# Altium schematic sheet camera_interface.SchDoc
size A3
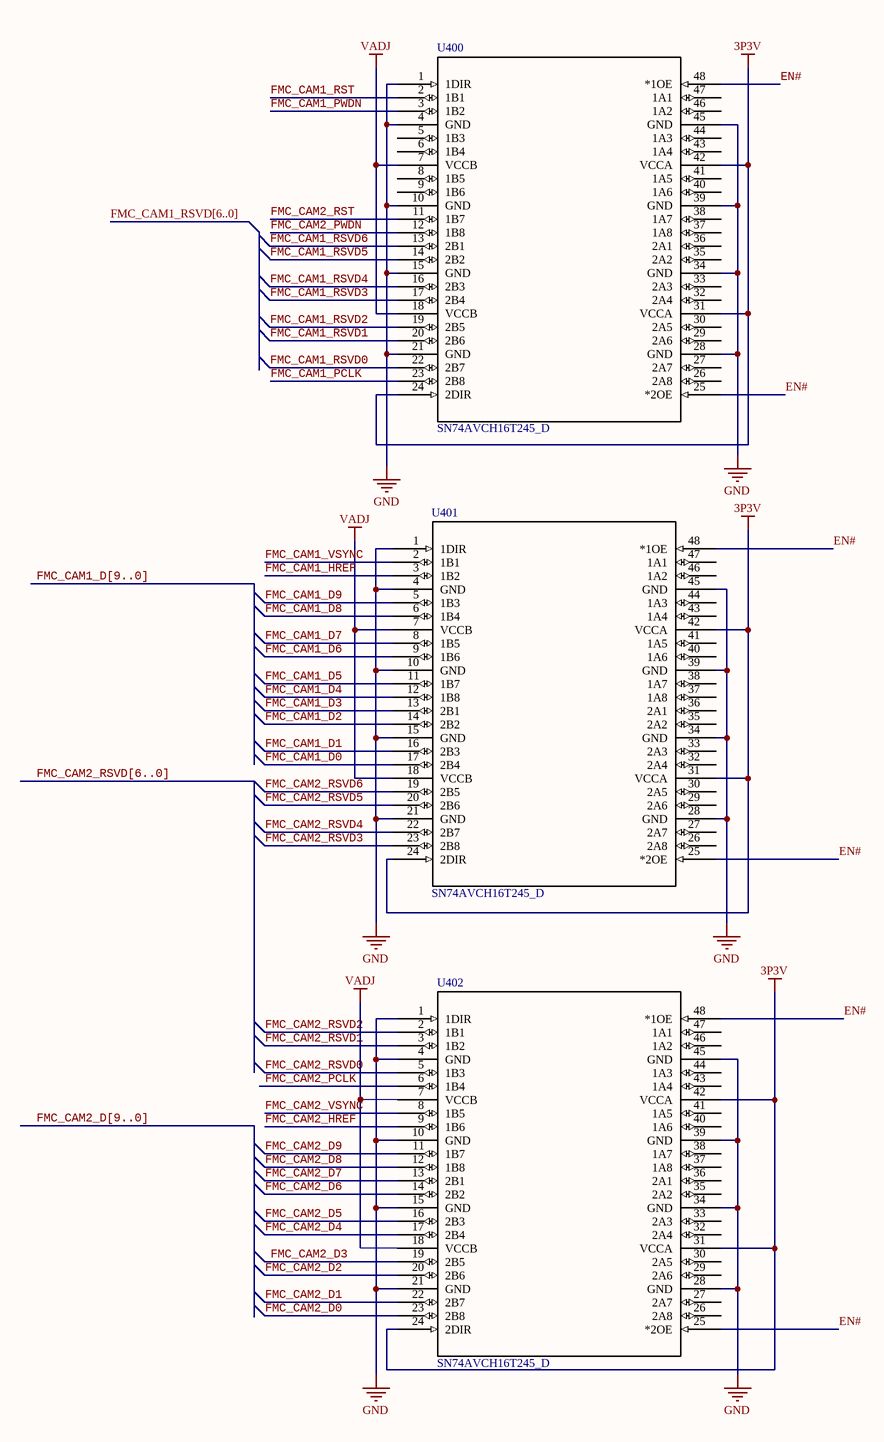
[diagram p0: camera_interface.SchDoc]

## Parts
U400  SN74AVCH16T245_D  [DGV48]
U401  SN74AVCH16T245_D  [DGV48]
U402  SN74AVCH16T245_D  [DGV48]

## Nets
3P3V: U400.24(2DIR) U400.31(VCCA) U400.42(VCCA) U401.24(2DIR) U401.31(VCCA) U401.42(VCCA) U402.24(2DIR) U402.31(VCCA) U402.42(VCCA)
GND: U400.1(1DIR) U400.4(GND) U400.10(GND) U400.15(GND) U400.21(GND) U400.28(GND) U400.34(GND) U400.39(GND) U400.45(GND) U401.1(1DIR) U401.4(GND) U401.10(GND) U401.15(GND) U401.21(GND) U401.28(GND) U401.34(GND) U401.39(GND) U401.45(GND) U402.1(1DIR) U402.4(GND) U402.10(GND) U402.15(GND) U402.21(GND) U402.28(GND) U402.34(GND) U402.39(GND) U402.45(GND)
VADJ: U400.7(VCCB) U400.18(VCCB) U401.7(VCCB) U401.18(VCCB) U402.7(VCCB) U402.18(VCCB)
EN#: U400.25(*2OE) U400.48(*1OE) U401.25(*2OE) U401.48(*1OE) U402.25(*2OE) U402.48(*1OE)
FMC_CAM1_D0: U401.17(2B4)
FMC_CAM1_D1: U401.16(2B3)
FMC_CAM1_D2: U401.14(2B2)
FMC_CAM1_D3: U401.13(2B1)
FMC_CAM1_D4: U401.12(1B8)
FMC_CAM1_D5: U401.11(1B7)
FMC_CAM1_D6: U401.9(1B6)
FMC_CAM1_D7: U401.8(1B5)
FMC_CAM1_D8: U401.6(1B4)
FMC_CAM1_D9: U401.5(1B3)
FMC_CAM1_HREF: U401.3(1B2)
FMC_CAM1_PCLK: U400.23(2B8)
FMC_CAM1_PWDN: U400.3(1B2)
FMC_CAM1_RST: U400.2(1B1)
FMC_CAM1_RSVD0: U400.22(2B7)
FMC_CAM1_RSVD1: U400.20(2B6)
FMC_CAM1_RSVD2: U400.19(2B5)
FMC_CAM1_RSVD3: U400.17(2B4)
FMC_CAM1_RSVD4: U400.16(2B3)
FMC_CAM1_RSVD5: U400.14(2B2)
FMC_CAM1_RSVD6: U400.13(2B1)
FMC_CAM1_VSYNC: U401.2(1B1)
FMC_CAM2_D0: U402.23(2B8)
FMC_CAM2_D1: U402.22(2B7)
FMC_CAM2_D2: U402.20(2B6)
FMC_CAM2_D3: U402.19(2B5)
FMC_CAM2_D4: U402.17(2B4)
FMC_CAM2_D5: U402.16(2B3)
FMC_CAM2_D6: U402.14(2B2)
FMC_CAM2_D7: U402.13(2B1)
FMC_CAM2_D8: U402.12(1B8)
FMC_CAM2_D9: U402.11(1B7)
FMC_CAM2_HREF: U402.9(1B6)
FMC_CAM2_PCLK: U402.6(1B4)
FMC_CAM2_PWDN: U400.12(1B8)
FMC_CAM2_RST: U400.11(1B7)
FMC_CAM2_RSVD0: U402.5(1B3)
FMC_CAM2_RSVD1: U402.3(1B2)
FMC_CAM2_RSVD2: U402.2(1B1)
FMC_CAM2_RSVD3: U401.23(2B8)
FMC_CAM2_RSVD4: U401.22(2B7)
FMC_CAM2_RSVD5: U401.20(2B6)
FMC_CAM2_RSVD6: U401.19(2B5)
FMC_CAM2_VSYNC: U402.8(1B5)

Not connected (* = marked no-connect by the designer): U400 5(1B3) 6(1B4) 8(1B5) 9(1B6) 26(2A8) 27(2A7) 29(2A6) 30(2A5) 32(2A4) 33(2A3) 35(2A2) 36(2A1) 37(1A8) 38(1A7) 40(1A6) 41(1A5) 43(1A4) 44(1A3) 46(1A2) 47(1A1); U401 26(2A8) 27(2A7) 29(2A6) 30(2A5) 32(2A4) 33(2A3) 35(2A2) 36(2A1) 37(1A8) 38(1A7) 40(1A6) 41(1A5) 43(1A4) 44(1A3) 46(1A2) 47(1A1); U402 26(2A8) 27(2A7) 29(2A6) 30(2A5) 32(2A4) 33(2A3) 35(2A2) 36(2A1) 37(1A8) 38(1A7) 40(1A6) 41(1A5) 43(1A4) 44(1A3) 46(1A2) 47(1A1)

## Buses and harness runs
bus FMC_CAM1_D[9..0]
bus FMC_CAM1_RSVD[6..0]
bus FMC_CAM2_D[9..0]
bus FMC_CAM2_RSVD[6..0]

## Library data of the parts
U400-U402 = SN74AVCH16T245_D: Imported; Manufacturer: Texas Instruments; Manufacturer_Part_Number: sn74avch16t245_dgv_48; INDUSTRY_STD_PKG_TYPE: TVSOP; FAMILY_NAME: DIRECTION CONTROL DUAL SUPPLY TRANSLATOR; PIN_COUNT: 48; PACKAGE_DESIGNATOR: DGV; Datasheet URL: http://www.ti.com/lit/gpn/SN74AVCH16T245; GENERIC_PART_NUMBER: SN74AVCH16T245; Vendor: Texas Instruments; RefDes: RefDes; Type: DEV; Value: Value